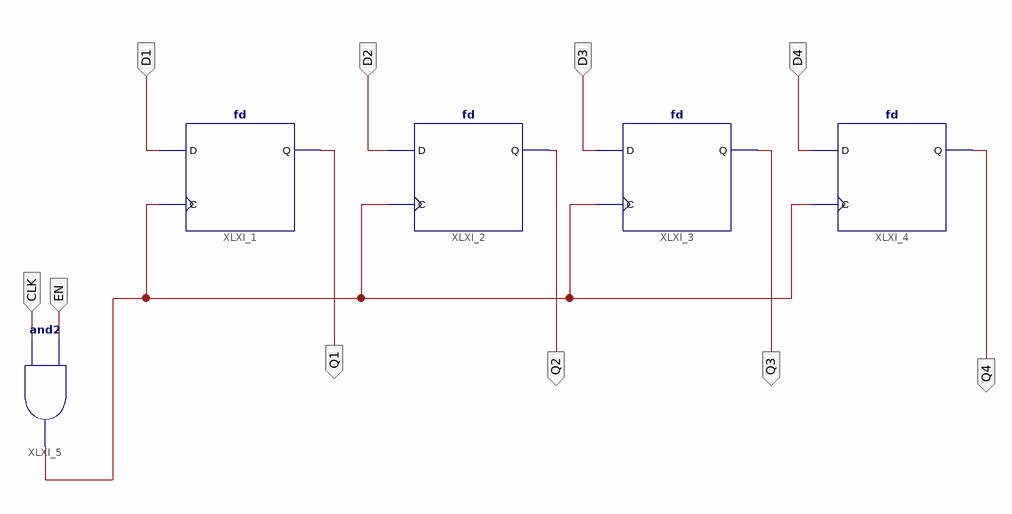
[diagram p0: schematic sheet 1]
// Xilinx ISE schematic Four_bit_register.sch (spartan3e) as structural Verilog: 5 symbols, 10 ports
module Four_bit_register (
  input  D1,
  input  D2,
  input  D3,
  input  D4,
  input  EN,
  input  CLK,
  output Q1,
  output Q2,
  output Q3,
  output Q4
);

  wire XLXN_3;

  fd XLXI_1 (.C(XLXN_3), .D(D1), .Q(Q1));
  fd XLXI_2 (.C(XLXN_3), .D(D2), .Q(Q2));
  fd XLXI_3 (.C(XLXN_3), .D(D3), .Q(Q3));
  fd XLXI_4 (.C(XLXN_3), .D(D4), .Q(Q4));
  and XLXI_5 (XLXN_3, CLK, EN);
endmodule
